# EAGLE design XIAO ESP32S3 Exp. Board v1.0 (EAGLE 9.6.2)
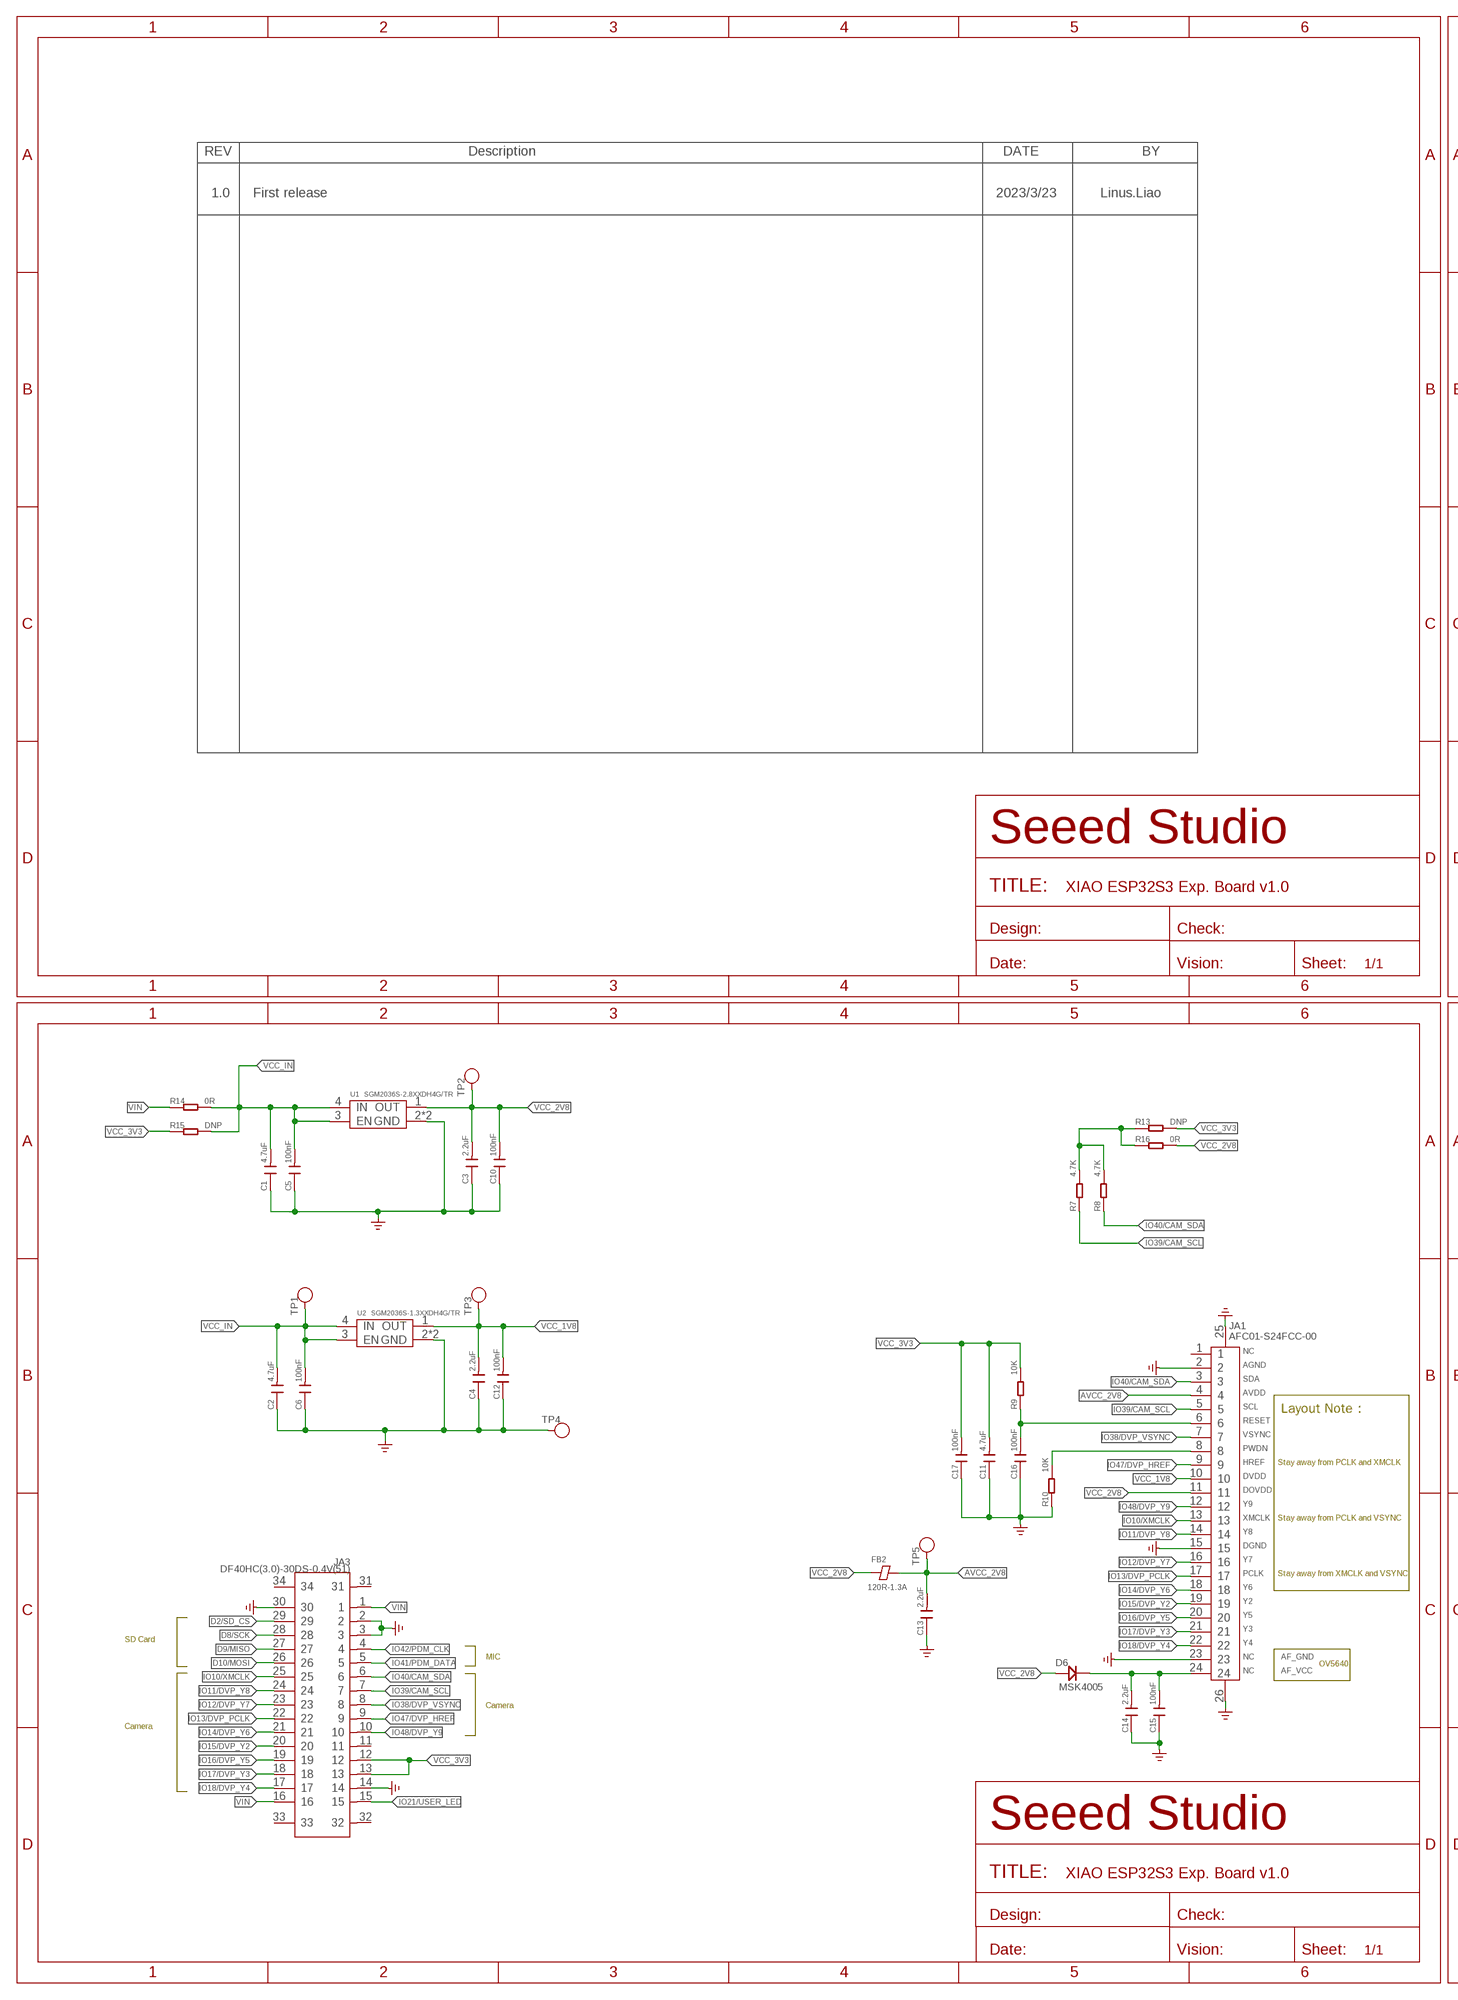
[diagram p0: schematic, sheet 1, part 1 of 2]
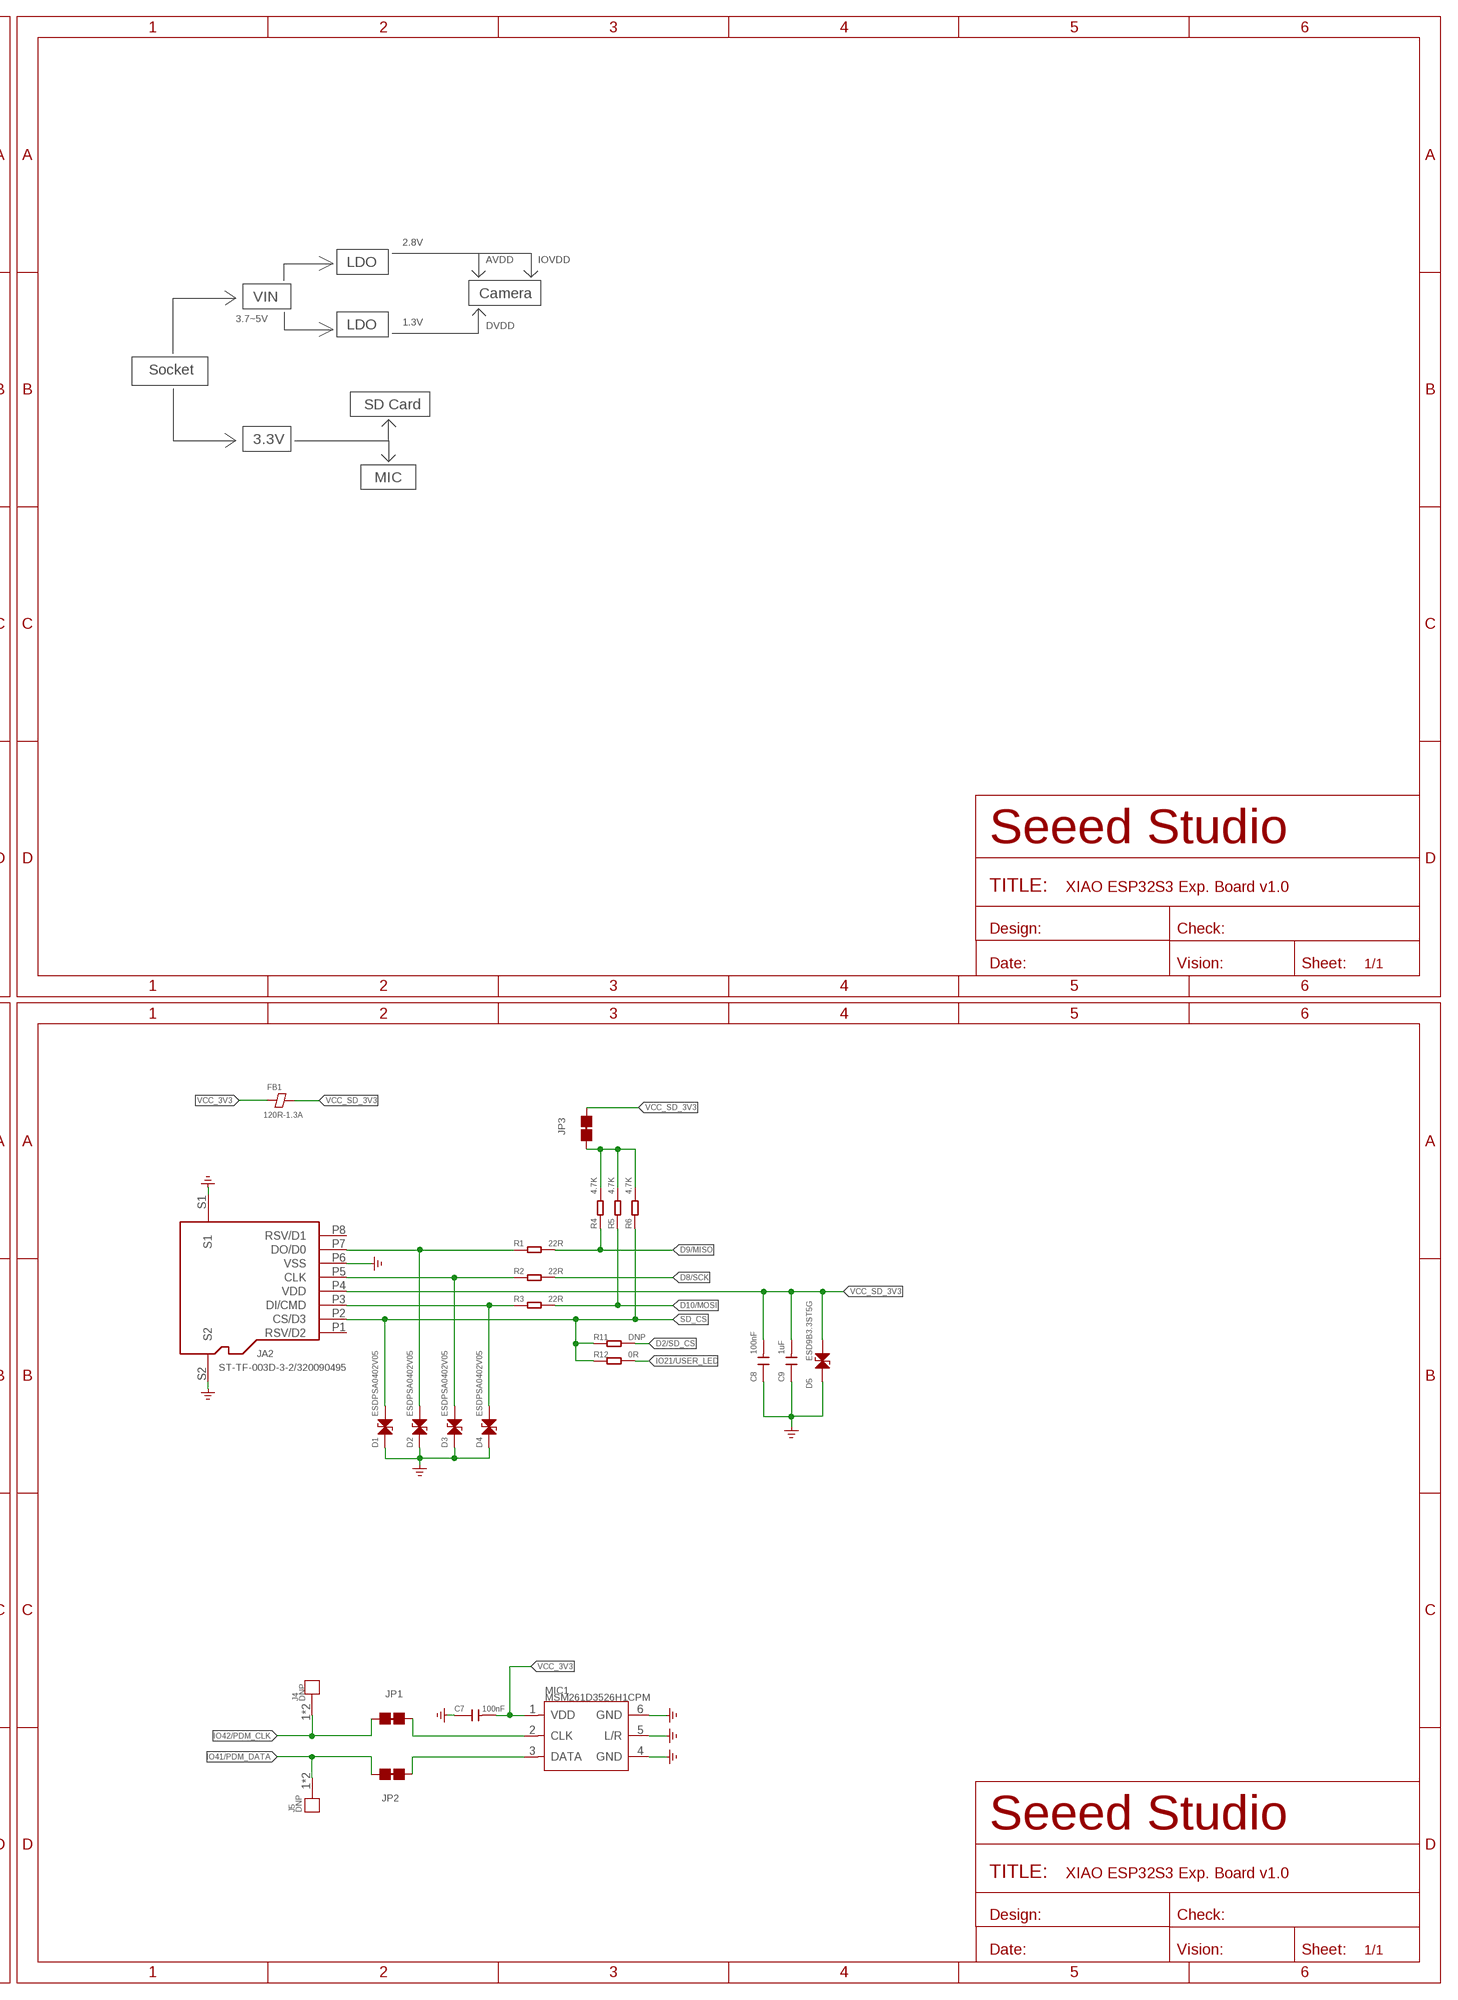
[diagram p1: schematic, sheet 1, part 2 of 2]

## Parts
C1  4.7uF  C-0402  [C0402]
C2  4.7uF  C-0402  [C0402]
C3  2.2uF  C-0402  [C0402]
C4  2.2uF  C-0402  [C0402]
C5  100nF  C-0402  [C0402]
C6  100nF  C-0402  [C0402]
C7  100nF  C-0402  [C0402]
C8  100nF  C-0402  [C0402]
C9  1uF  C-0402  [C0402]
C10  100nF  C-0402  [C0402]
C11  4.7uF  C-0402  [C0402]
C12  100nF  C-0402  [C0402]
C13  2.2uF  C-0402  [C0402]
C14  2.2uF  C-0402  [C0402]
C15  100nF  C-0402  [C0402]
C16  100nF  C-0402  [C0402]
C17  100nF  C-0402  [C0402]
D1  ESDPSA0402V05  D-ESD-2P-DOUBLE  [ESD-0402-NO-SILK]
D2  ESDPSA0402V05  D-ESD-2P-DOUBLE  [ESD-0402-NO-SILK]
D3  ESDPSA0402V05  D-ESD-2P-DOUBLE  [ESD-0402-NO-SILK]
D4  ESDPSA0402V05  D-ESD-2P-DOUBLE  [ESD-0402-NO-SILK]
D5  ESD9B3.3ST5G  D-ESD-2P-DOUBLE  [ESD-0402-NO-SILK]
D6  MSK4005  DIODE'0603'  [SOD-523]
FB1  120R-1.3A  FERRITE-BEAD-0402  [F0402]
FB2  120R-1.3A  FERRITE-BEAD-0402  [F0402]
J4  DNP  HEADER-1P-HALF-HOLE  [H1-HALF-HOLE-2.54]
J5  DNP  HEADER-1P-HALF-HOLE  [H1-HALF-HOLE-2.54]
JA1  AFC01-S24FCC-00  FPC-CONNECTOR-24P  [FPCB24-SMD-0.5-17.6X5.0X2MM]
JA2  ST-TF-003D-3-2/320090495  MICRO-SD-CARD-HOLDER-SHORT-8P  [MICRO-SD8+2P-SMD-1.1-11.41X4.9X3MM]
JA3  DF40HC(3.0)-30DS-0.4V(51)  BTB-P4S30DF40HC-SOCKET  [BTB30-0.4-8.6X3.38X2.4MM]
JP1  JP-2P-SHORT  [2P-SMD-0603]
JP2  JP-2P-SHORT  [2P-SMD-0603]
JP3  JP-2P-SHORT  [2P-SMD-0603]
MIC1  MSM261D3526H1CPM  MIC-MSM261D3526H1CPM  [MIC6P-3.5X2.65X0.94MM]
R1  22R  R-0402  [R0402]
R2  22R  R-0402  [R0402]
R3  22R  R-0402  [R0402]
R4  4.7K  R-0402  [R0402]
R5  4.7K  R-0402  [R0402]
R6  4.7K  R-0402  [R0402]
R7  4.7K  R-0402  [R0402]
R8  4.7K  R-0402  [R0402]
R9  10K  R-0402  [R0402]
R10  10K  R-0402  [R0402]
R11  DNP  R-0402  [R0402]
R12  0R  R-0402  [R0402]
R13  DNP  R-0402  [R0402]
R14  0R  R-0402  [R0402]
R15  DNP  R-0402  [R0402]
R16  0R  R-0402  [R0402]
TP1  TEST-POINT-35  [TP_3535]
TP2  TEST-POINT-35  [TP_3535]
TP3  TEST-POINT-35  [TP_3535]
TP4  TEST-POINT-35  [TP_3535]
TP5  TEST-POINT-35  [TP_3535]
U1  SGM2036S-2.8XXDH4G/TR  TLV733P  [X2SON-4]
U2  SGM2036S-1.3XXDH4G/TR  TLV733P  [X2SON-4]

## Nets
AVCC_2V8: C13.2 FB2.2 JA1.4 TP5.T
D2/SD_CS: JA3.29 R11.2
D8/SCK: JA3.28 R2.2
D9/MISO: JA3.27 R1.2 R4.1
D10/MOSI: JA3.26 R3.2 R5.1
GND: C1.1 C2.1 C3.1 C4.1 C5.1 C6.1 C7.1 C8.1 C9.1 C10.1 C11.1 C12.1 C13.1 C14.1 C15.1 C16.1 C17.1 D1.1 D2.1 D3.1 D4.1 D5.1 JA1.2 JA1.15 JA1.23 JA1.25(P1) JA1.26(P2) JA2.P6(VSS) JA2.S1 JA2.S2 JA3.2 JA3.3 JA3.14 JA3.30 MIC1.4(GND) MIC1.5(L/R) MIC1.6(GND) R10.1 TP4.T U1.2(GND) U1.T(GND) U2.2(GND) U2.T(GND) ; supply symbol labelled GND_POWER
IO10/XMCLK: JA1.13 JA3.25
IO11/DVP_Y8: JA1.14 JA3.24
IO12/DVP_Y7: JA1.16 JA3.23
IO13/DVP_PCLK: JA1.17 JA3.22
IO14/DVP_Y6: JA1.18 JA3.21
IO15/DVP_Y2: JA1.19 JA3.20
IO16/DVP_Y5: JA1.20 JA3.19
IO17/DVP_Y3: JA1.21 JA3.18
IO18/DVP_Y4: JA1.22 JA3.17
IO21/USER_LED: JA3.15 R12.2
IO38/DVP_VSYNC: JA1.7 JA3.8
IO39/CAM_SCL: JA1.5 JA3.7 R7.1
IO40/CAM_SDA: JA1.3 JA3.6 R8.1
IO41/PDM_DATA: J5.1 J5.2 JA3.5 JP2.P2
IO42/PDM_CLK: J4.1 J4.2 JA3.4 JP1.P1
IO47/DVP_HREF: JA1.9 JA3.9
IO48/DVP_Y9: JA1.12 JA3.10
N$1: JP1.P2 MIC1.2(CLK)
N$2: JP2.P1 MIC1.3(DATA)
N$3: D2.2 JA2.P7(DO/D0) R1.1
N$4: D3.2 JA2.P5(CLK) R2.1
N$5: JP3.P1 R4.2 R5.2 R6.2
N$6: D4.2 JA2.P3(DI/CMD) R3.1
N$7: C16.2 JA1.6 R9.1
N$8: C14.2 C15.2 D6.- JA1.24
N$9: R7.2 R8.2 R13.1 R16.1
N$10: JA1.8 R10.2
SD_CS: D1.2 JA2.P2(CS/D3) R6.1 R11.1 R12.1
VCC_1V8: C4.2 C12.2 JA1.10 TP3.T U2.1(OUT)
VCC_2V8: C3.2 C10.2 D6.+ FB2.1 JA1.11 R16.2 TP2.T U1.1(OUT)
VCC_3V3: C7.2 C11.2 C17.2 FB1.1 JA3.12 JA3.13 MIC1.1(VDD) R9.2 R13.2 R15.1
VCC_IN: C1.2 C2.2 C5.2 C6.2 R14.2 R15.2 TP1.T U1.3(EN) U1.4(IN) U2.3(EN) U2.4(IN)
VCC_SD_3V3: C8.2 C9.2 D5.2 FB1.2 JA2.P4(VDD) JP3.P2
VIN: JA3.1 JA3.16 R14.1
Unconnected: JA1.1 JA2.P1(RSV/D2) JA2.P8(RSV/D1) JA3.11 JA3.31 JA3.32 JA3.33 JA3.34

## Notes on the sheet
- 1.0 | First release | 2023/3/23 | Linus.Liao
- 2.8V
- AVDD | IOVDD
- LDO
- VIN | Camera
- 3.7~5V
- 1.3V
- LDO | DVDD
- Socket
- SD Card
- 3.3V
- MIC
- NC
- AGND
- SDA
- AVDD
- SCL
- Layout Note：
- RESET
- VSYNC
- PWDN
- HREF | Stay away from PCLK and XMCLK
- DVDD
- DOVDD
- Y9
- XMCLK | Stay away from PCLK and VSYNC
- Y8
- DGND
- Y7
- PCLK | Stay away from XMCLK and VSYNC
- Y6
- Y2
- Y5
- Y3
- SD Card
- Y4
- MIC | NC | AF_GND
- OV5640
- NC | AF_VCC
- Camera
- Camera

## Library data of the parts
C1-C17 = Discrete-small:C*: Ceramic Capacitors
D1-D5 = Discrete-new:D-ESD-2P-DOUBLE
D6 = Discrete-new:DIODE
FB1 FB2 = Discrete-new:FERRITE-BEAD
J4 J5 = Connector-new:HEADER-1P
JA1 = Connector-new:FPC-CONNECTOR-24P
JA2 = Connector-new:MICRO-SD-CARD-HOLDER-SHORT-8P
JA3 = Connector-new:BTB-P4S30
JP1-JP3 = Discrete-new:JP-2P-SHORT
MIC1 = Making:MIC-MSM261D3526H1CPM
R1-R16 = Discrete-small:R*
TP1-TP5 = Discrete-new:TEST-POINT
U1 U2 = GroveX:TLV733P

## Net classes
0 default: width 0.089 mm, drill 0.2 mm, clearance 0.102 mm

## Board
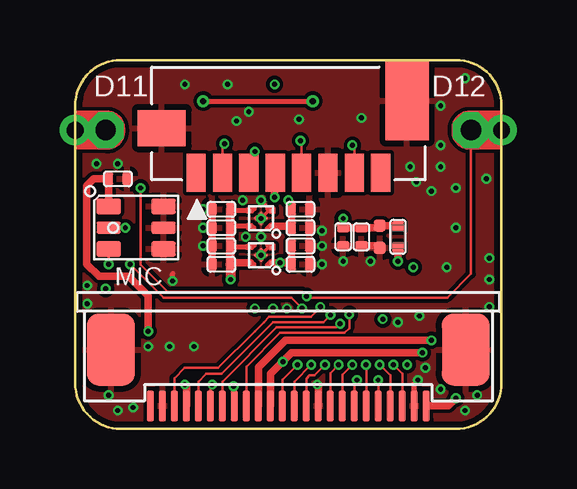
[diagram p2: board, top side]
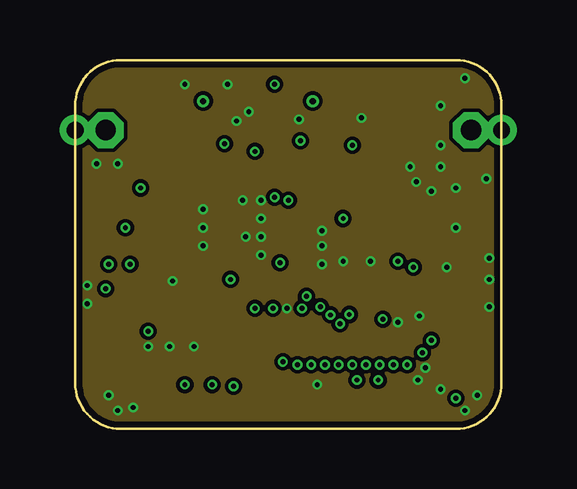
[diagram p3: board, inner layer Route2]
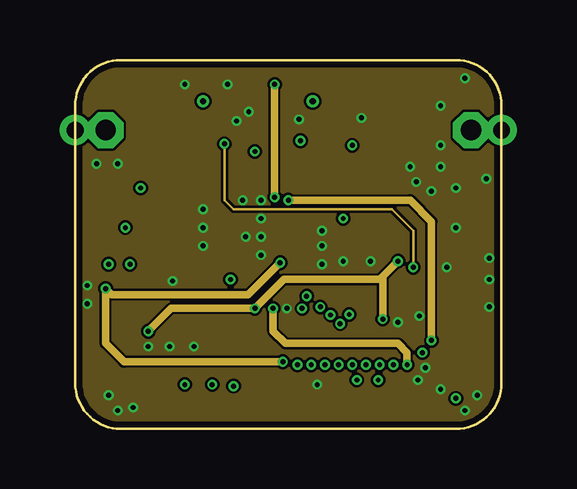
[diagram p4: board, inner layer Route15]
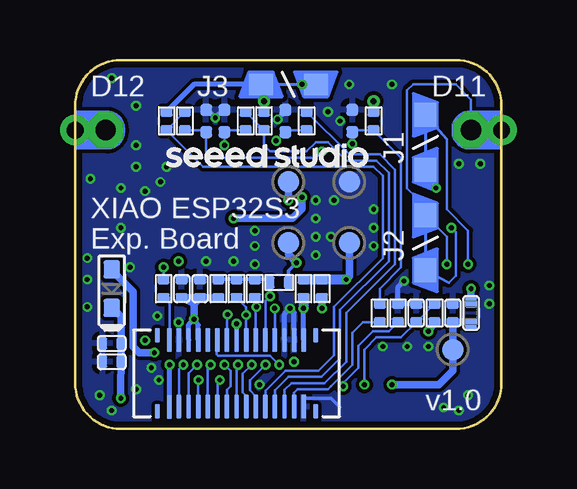
[diagram p5: board, bottom side, seen from below]

Size 17.78 x 15.37 mm. Coordinates in mm from the lower left corner, seen from the top.
Outline: 0,1.9 0,13.46 arc-90 1.91,15.37 15.88,15.37 arc-90 17.78,13.46 17.78,1.9 arc-90 15.88,0 1.91,0 arc-90 0,1.9
Copper layers (1*2*15*16): Top 0.035mm / dielectric 0.2mm / Route2 0.0175mm / dielectric 0.3mm / Route15 0.0175mm / dielectric 0.2mm / Bottom 0.035mm
Design rules "SeeedStudio_4layer_DRU_no_angle_20140221 *": minimum track width 1mil, minimum drill 8mil, track to track 4mil, track to pad 4mil, pad to pad 4mil, via to via 4mil, smd to smd 0mil, copper to edge 10mil, drill to drill 8mil, minimum pad ring 4mil, minimum via ring 4mil, stop-mask expansion 4mil, vias tented up to drill 25mil, thermal gap 10mil

### Footprints (pad centres in the part's own frame; a part is rotated, then mirrored left to right if it is on the bottom)
C0402 = smd 0.385 x 0.508: 1 0.383,0; 2 -0.383,0
ESD-0402-NO-SILK = smd 0.5 x 0.5: 1 -0.463,0; 2 0.463,0
SOD-523 = smd 0.762 x 0.7: + 0.8,0; - -0.8,0
F0402 = smd 0.445 x 0.508: 1 -0.445,0; 2 0.445,0
H1-HALF-HOLE-2.54 = drill 0.85 pad 1.5 octagon: 1 0,0 | drill 0.7 pad 1.27: 2 -1.27,0
FPCB24-SMD-0.5-17.6X5.0X2MM = smd 0.3 x 1.3: 1 5.75,0; 2 5.25,0; 3 4.75,0; 4 4.25,0; 5 3.75,0; 6 3.25,0; 7 2.75,0; 8 2.25,0; 9 1.75,0; 10 1.25,0; 11 0.75,0; 12 0.25,0; 13 -0.25,0; 14 -0.75,0; 15 -1.25,0; 16 -1.75,0; 17 -2.25,0; 18 -2.75,0; 19 -3.25,0; 20 -3.75,0; 21 -4.25,0; 22 -4.75,0; 23 -5.25,0; 24 -5.75,0 | smd 2 x 3: 25 -7.4,-2.35; 26 7.4,-2.35
MICRO-SD8+2P-SMD-1.1-11.41X4.9X3MM = smd 1.6 x 0.8: P1 0,3.85; P2 0,2.75; P3 0,1.65; P4 0,0.55; P5 0,-0.55; P6 0,-1.65; P7 0,-2.75; P8 0,-3.85 | smd 1.5 x 2: S1 1.86,5.28 | smd 3.3 x 1.8: S2 3,-4.95
BTB30-0.4-8.6X3.38X2.4MM = smd 0.2 x 1: 1 -2.8,-1.39; 2 -2.4,-1.39; 3 -2,-1.39; 4 -1.6,-1.39; 5 -1.2,-1.39; 6 -0.8,-1.39; 7 -0.4,-1.39; 8 0,-1.39; 9 0.4,-1.39; 10 0.8,-1.39; 11 1.2,-1.39; 12 1.6,-1.39; 13 2,-1.39; 14 2.4,-1.39; 15 2.8,-1.39; 16 2.8,1.4; 17 2.4,1.39; 18 2,1.39; 19 1.6,1.39; 20 1.2,1.39; 21 0.8,1.39; 22 0.4,1.39; 23 0,1.39; 24 -0.4,1.39; 25 -0.8,1.39; 26 -1.2,1.39; 27 -1.6,1.39; 28 -2,1.39; 29 -2.4,1.39; 30 -2.8,1.39 | smd 0.2 x 0.6: 31 -3.3,-1.59; 32 3.3,-1.59; 33 3.3,1.59; 34 -3.3,1.59
2P-SMD-0603 = smd 1 x 0.9: P1 -1.143,0; P2 1.143,0
MIC6P-3.5X2.65X0.94MM = smd 0.635 x 1.016: 1 0.889,1.143; 3 -0.889,1.143; 4 -0.889,-1.143; 6 0.889,-1.143 | smd 0.508 x 1.016: 2 0,1.143; 5 0,-1.143
R0402 = smd 0.385 x 0.508: 1 0.383,0; 2 -0.383,0
TP_3535 = smd 0.889 x 0.889: T 0,0
X2SON-4 = smd 0.152 x 0.152: 1 -0.445,0.318; 2 -0.445,-0.318; 3 0.445,-0.318; 4 0.445,0.318 | smd 0.45 x 0.45 rotated 45: T 0,0

### Placement (x,y rotation side)
C1  6.1,6.86 180 top
C2  6.1,8.38 180 top
C3  9.4,6.86 0 top
C4  9.4,9.14 0 top
C5  6.1,7.62 180 top
C6  6.1,9.14 180 top
C7  1.78,10.41 0 top
C8  11.18,8 270 top
C9  11.94,8 270 top
C10  9.4,7.62 0 top
C11  12.57,5.84 90 bottom
C12  9.4,8.38 0 top
C13  2.03,4.83 90 bottom
C14  16.26,3.56 180 bottom
C15  16.26,2.79 180 bottom
C16  3.56,4.83 90 bottom
C17  13.33,5.84 90 bottom
D1  6.22,12.83 270 bottom
D2  11.56,12.83 270 bottom
D3  9.02,12.83 270 bottom
D4  12.32,12.83 270 bottom
D5  12.7,8 90 top
D6  16.26,5.84 90 bottom
FB1  13.46,8 90 top
FB2  1.27,4.83 270 bottom
J4  1.27,12.45 0 top
J5  16.51,12.45 180 top
JA1  8.89,0.95 180 top
JA2  8.89,10.67 90 top
JA3  11.05,2.31 180 bottom
JP1  3.17,7.75 270 bottom
JP2  3.17,11.94 270 bottom
JP3  8.89,14.35 0 bottom
MIC1  2.54,8.38 90 top
R1  10.67,12.83 270 bottom
R2  8.13,12.83 270 bottom
R3  13.21,12.83 270 bottom
R4  9.91,12.83 270 bottom
R5  13.97,12.83 270 bottom
R6  5.33,12.83 270 bottom
R7  11.05,5.84 270 bottom
R8  10.29,5.84 270 bottom
R9  2.79,4.83 90 bottom
R10  4.32,4.83 90 bottom
R11  5.08,4.83 90 bottom
R12  14.1,5.84 90 bottom
R13  11.81,5.84 90 bottom
R14  8.26,5.84 270 bottom
R15  7.49,5.84 270 bottom
R16  9.27,6.1 180 bottom
TP1  6.35,7.75 0 bottom
TP2  8.89,7.75 0 bottom
TP3  8.89,10.29 0 bottom
TP4  6.35,10.29 0 bottom
TP5  2.03,3.3 270 bottom
U1  7.75,7.24 180 top
U2  7.75,8.76 180 top
U$6  [LOGO-SEEED-NEW-0.94X8.4MM]  13.97,10.92 0 bottom

### Tracks (layer width: path | path; a pad name or v marks a point on that pad's centre or on a via)
AVCC_2V8  (via drill 0.2 pad 0.41)
  Top 0.305: JA1.4 4.64,1.77 v4.57,1.84
  Bottom 0.305: FB2.2 1.33,4.44 C13.2 TP5.T 2.03,2.41 2.6,1.84 v4.57,1.84
D2/SD_CS
  Bottom 0.102: 8.65,1.26 JA3.29 8.65,1.51 8.51,1.65 7.24,1.65 7.11,1.78 | 7.11,1.78 | R11.2 5.77,4.44 6.22,4 6.22,2.67 7.11,1.78
D8/SCK
  Bottom 0.102: R2.2 6.35,11.43 5.08,11.43 4.45,10.79 4.45,6.86 6.48,4.83 6.48,2.8 7.38,1.9 8.76,1.9 9.05,1.62 JA3.28
D9/MISO
  Bottom 0.102: R1.2 R4.1 9.91,11.81 9.65,11.56 8.13,11.56 7.75,11.94 7.24,11.94 6.48,11.18 5.21,11.18 4.7,10.67 4.7,6.98 6.73,4.95 6.73,2.93 7.51,2.16 8.89,2.16 9.45,1.6 JA3.27
D10/MOSI
  Bottom 0.102: R3.2 R5.1 12.45,10.92 5.33,10.92 4.95,10.54 4.95,7.11 6.98,5.08 6.98,3.07 7.64,2.41 9.02,2.41 9.85,1.58 JA3.26
GND  (via drill 0.2 pad 0.41)
  Top 0.152: U2.2 8.06,9.08 | 8.06,9.08 U2.T | U1.2 8.06,7.56 U1.T | 8.06,9.08 8.06,9.21 v7.75,9.52
  Top 0.203: JA1.23 14.14,1.88 v14.29,2.03 | v4.06,6.16 4.06,6.48
  Top 0.305: JA1.15 10.14,1.82 v10.1,1.84 | C1.1 C5.1 C2.1 C6.1 | C9.1 12.62,7.62 D5.1
  Bottom 0.152: JA3.2 8.65,4.14 | JA3.30 8.25,1.26 8.13,1.27 7.11,1.27 6.73,0.89
  Bottom 0.203: JA3.3 9.05,4.79 v8.83,5.02 8.65,4.84 8.65,4.14 | D4.1 12.27,13.29 v11.94,12.95 11.6,13.29 D2.1 | v9.33,12.89 9.02,13.21 D3.1 | C16.1 R10.1 4.32,5.91 v4.06,6.16
  other vias: 5.33,9.14 7.75,8 10.29,7.62 10.29,8.25 17.27,6.22 7.24,13.21 1.4,1.4 2.41,0.89 16.26,0.76 13.46,4.45 15.24,10.92 13.97,10.92 15.24,13.46 16.26,14.61 5.33,7.62 5.33,8.38 6.73,12.83 17.15,10.41 17.27,7.11 14.22,10.29 7.11,8 6.98,9.52 15.88,10.03 14.86,9.91 15.49,6.73 0.89,11.05 7.75,7.24 7.75,8.76 11.18,6.98 12.32,6.98 10.29,6.86 17.27,5.08 16.76,1.4 14.61,2.54 3.05,3.43 3.94,3.43 0.51,5.97 0.51,5.21 1.78,0.76 4.95,3.43 15.24,1.65 14.35,4.7 6.35,14.35 4.57,14.35 1.78,11.05 15.24,11.81 15.88,8.38
  pour Top (isolate 0.152): 0,15.37 17.78,15.37 17.78,-0.25 0,-0.25
  pour Bottom (isolate 0.152): 0,15.37 17.78,15.37 17.78,-0.25 0,-0.25
  pour Route2 (isolate 0.152): 0,15.37 17.78,15.37 17.78,-0.25 0,-0.25
  pour Route15: 0,15.37 18.42,15.37 18.42,-0.25 0,-0.25
IO10/XMCLK  (via drill 0.2 pad 0.41)
  Top 0.102: JA1.13 9.14,1.96 v9.84,2.67
  Bottom 0.102: JA3.25 10.25,1.36 10.49,1.6 10.49,2.02 v9.84,2.67
IO11/DVP_Y8  (via drill 0.2 pad 0.41)
  Top 0.102: JA1.14 9.64,2.08 9.78,2.22 9.97,2.22 v10.41,2.67
  Bottom 0.102: JA3.24 10.65,1.38 10.79,1.52 10.79,2.29 v10.41,2.67
IO12/DVP_Y7  (via drill 0.2 pad 0.41)
  Top 0.102: JA1.16 10.64,2.32 v10.99,2.67
  Bottom 0.102: JA3.23 11.05,2.6 v10.99,2.67
IO13/DVP_PCLK  (via drill 0.2 pad 0.41)
  Top 0.102: JA1.17 11.14,2.25 v11.56,2.67
  Bottom 0.102: v11.56,2.67 11.3,2.41 11.3,1.78 11.45,1.63 JA3.22
IO14/DVP_Y6  (via drill 0.2 pad 0.41)
  Top 0.102: JA1.18 11.64,1.92 v11.75,2.03
  Bottom 0.102: JA3.21 11.85,1.93 v11.75,2.03
IO15/DVP_Y2  (via drill 0.2 pad 0.41)
  Top 0.102: JA1.19 12.14,2.66 v12.13,2.67
  Bottom 0.102: JA3.20 12.25,2.55 v12.13,2.67
IO16/DVP_Y5  (via drill 0.2 pad 0.41)
  Top 0.102: JA1.20 12.64,1.91 v12.64,2.03
  Bottom 0.102: JA3.19 12.65,2.02 v12.64,2.03
IO17/DVP_Y3  (via drill 0.2 pad 0.41)
  Top 0.102: JA1.21 13.14,2.23 v12.7,2.67
  Bottom 0.102: JA3.18 13.05,2.32 v12.7,2.67
IO18/DVP_Y4  (via drill 0.2 pad 0.41)
  Top 0.102: 13.72,1.03 JA1.22 13.64,2.3 v13.27,2.67
  Bottom 0.102: JA3.17 13.45,2.49 v13.27,2.67
IO21/USER_LED
  Bottom 0.102: JA3.15 13.85,5.45 R12.2
IO38/DVP_VSYNC  (via drill 0.2 pad 0.41)
  Top 0.102: JA1.7 6.14,1.96 8.4,4.23 10.87,4.23 v11.05,4.38
  Bottom 0.102: JA3.8 v11.05,4.38
IO39/CAM_SCL  (via drill 0.2 pad 0.41)
  Top 0.102: v10.65,4.74 10.35,4.45 8.26,4.45 6.1,2.29 5.46,2.29 5.14,1.96 JA1.5
  Bottom 0.102: JA3.7 v10.65,4.74 10.65,5.06 R7.1
IO40/CAM_SDA  (via drill 0.2 pad 0.41)
  Top 0.102: v10.22,5.08 9.83,4.66 8.09,4.66 7.87,4.45 7.49,4.06 5.97,2.54 4.57,2.54 4.14,2.11 JA1.3
  Bottom 0.102: JA3.6 10.25,5.05 v10.22,5.08 10.22,5.39 R8.1
IO41/PDM_DATA  (via drill 0.2 pad 0.41)
  Top 0.102: J5.1 16.51,6.45 15.52,5.46 9.72,5.46 v9.65,5.52 9.46,5.71 3.86,5.71 2.73,6.85 v2.73,10.03
  Bottom 0.102: J5.1 J5.2 | JA3.5 9.85,5.33 v9.65,5.52 | JP2.P2 v2.73,10.03
IO42/PDM_CLK  (via drill 0.2 pad 0.41)
  Top 0.102: v9.46,5.02 9.02,5.46 3.68,5.46 v2.29,6.86
  Bottom 0.102: J4.2 J4.1 1.27,13.72 1.91,14.35 3.68,14.35 3.94,14.1 3.94,10.03 3.56,9.65 3.56,9.27 JP1.P1 2.29,8 v2.29,6.86 | JA3.4 9.45,5 v9.46,5.02
IO47/DVP_HREF  (via drill 0.2 pad 0.41)
  Top 0.102: JA1.9 7.14,2.59 8.55,4 11.24,4 11.43,4.19 v11.43,4.76
  Bottom 0.102: JA3.9 11.45,4.74 v11.43,4.76
IO48/DVP_Y9  (via drill 0.2 pad 0.41)
  Top 0.102: JA1.12 8.64,2.04 v9.27,2.67
  Bottom 0.102: JA3.10 11.87,3.73 11.87,3.11 11.81,3.05 9.65,3.05 v9.27,2.67
N$1  (via drill 0.2 pad 0.41)
  Top 0.102: MIC1.2 v2.09,8.38
  Bottom 0.102: JP1.P2 2.19,6.1 1.91,6.38 1.91,8.19 v2.09,8.38
N$2  (via drill 0.2 pad 0.41)
  Top 0.102: v1.4,6.86 MIC1.3
  Bottom 0.102: v1.4,6.86 1.4,8.25 2.29,9.14 2.29,12.07 JP2.P1
N$3  (via drill 0.2 pad 0.41)
  Top 0.102: JA2.P7 11.64,11.73 v11.56,11.81
  Bottom 0.102: v11.56,11.81 D2.2 11.51,12.44 R1.1
N$4  (via drill 0.2 pad 0.41)
  Top 0.102: JA2.P5 9.44,11.96 v9.4,12
  Bottom 0.102: R2.1 8.94,12.44 D3.2 v9.4,12
N$5  (via drill 0.25 pad 0.51)
  Top 0.203: v5.33,13.65 v9.91,13.65
  Bottom 0.203: v9.91,13.65 9.91,13.84 | R5.2 12.83,14.35 JP3.P1 9.91,14.22 v9.91,13.65 | R6.2 v5.33,13.65 | v9.91,13.65 R4.2
N$6  (via drill 0.2 pad 0.41)
  Top 0.102: 7.24,10.54 JA2.P3 7.49,10.92 v7.49,11.56
  Bottom 0.102: R3.1 12.53,12.44 D4.2 | D4.2 12.45,12.45 | D4.2 12.32,11.56 12.06,11.3 7.75,11.3 v7.49,11.56
N$7  (via drill 0.2 pad 0.41)
  Top 0.102: JA1.6 5.64,1.79 v5.71,1.84
  Bottom 0.102: R9.1 C16.2 4.19,3.81 5.21,3.81 5.71,3.3 v5.71,1.84
N$8  (via drill 0.2 pad 0.41)
  Top 0.305: JA1.24 15.56,0.95 v15.88,1.27
  Bottom 0.305: v15.88,1.27 15.88,1.78 C15.2 15.87,3.37 C14.2 15.87,4.66 D6.-
N$9
  Bottom 0.152: R13.1 R7.2 R8.2 9.78,6.22 R16.1
N$10  (via drill 0.2 pad 0.41)
  Top 0.102: JA1.8 6.64,1.74 v6.6,1.78
  Bottom 0.102: v6.6,1.78 6.6,1.9 5.97,2.54 5.97,3.46 5.37,4.06 4.7,4.06 R10.2
SD_CS  (via drill 0.2 pad 0.41)
  Top 0.102: JA2.P2 6.14,11.79 v6.22,11.88
  Route15 0.102: v14.1,6.73 14.1,8.25 13.21,9.14 6.6,9.14 6.22,9.52 v6.22,11.88
  Bottom 0.102: v6.22,11.88 D1.2 6.14,12.44 R6.1 4.19,11.3 4.19,6.73 5.08,5.84 R11.1 | R12.1 v14.1,6.73
VCC_1V8  (via drill 0.2 pad 0.41)
  Top 0.305: U2.1 8.95,8.45 C12.2 C4.2 9.02,9.4 v8.89,9.52 | JA1.10 7.64,2.56 8.76,3.68 v14.86,3.68
  Route15 0.305: v14.86,3.68 14.86,8.64 13.97,9.52 v8.89,9.52
  Bottom 0.305: 8.76,10.16 TP3.T v8.89,9.52
VCC_2V8  (via drill 0.2 pad 0.41)
  Top 0.102: 9.02,3.17 9.02,3.15 v8.66,2.79
  Top 0.305: 9.02,7.24 | U1.1 v8.55,6.92 8.95,6.92 C3.2 9.02,7.24 | JA1.11 8.14,2.3 9.02,3.17 v14.48,3.17 | 9.02,7.24 C10.2
  Route15 0.305: v8.66,2.79 2.03,2.79 1.27,3.56 v1.27,5.84 1.52,5.59 7.21,5.59 v8.55,6.92
  Bottom 0.152: R16.2 8.89,6.58 v8.55,6.92
  Bottom 0.305: TP2.T 8.89,7.26 v8.55,6.92 | FB2.1 v1.27,5.84 | D6.+ 16.26,6.6 15.37,5.71 15.37,3.43 15.11,3.17 v14.48,3.17
VCC_3V3  (via drill 0.2 pad 0.41)
  Top 0.305: MIC1.1 C7.2 0.76,10.41 0.48,10.13 0.48,6.86 0.99,6.35 2.24,6.35 3.05,5.54 v3.05,4.06 | v13.46,6.98 FB1.1
  Route15 0.305: 12.83,6.35 12.7,6.22 8.7,6.22 v7.49,5.02 4,5.02 v3.05,4.06 | 12.83,6.35 v13.46,6.98 | v12.83,4.57 12.83,6.35
  Bottom 0.203: 13.05,5.43 C17.2 | JA3.13 13.05,4.35 v12.83,4.57 12.65,4.33 JA3.12
  Bottom 0.305: R15.1 v7.49,5.02 | C11.2 C17.2 12.83,5.2 | R9.2 v3.05,4.06 | C11.2 12.2,5.46 | v12.83,4.57 12.83,5.2 | 12.83,5.2 12.83,5.21 C11.2 | R13.2 C11.2
VCC_IN  (via drill 0.2 pad 0.41)
  Top 0.203: U2.4 6.54,8.45 C2.2 | U2.3 6.54,9.08 C6.2 | U1.3 6.54,7.56 C5.2
  Top 0.305: U1.4 6.54,6.92 C1.2
  Top 0.381: C1.2 C5.2 C2.2 C6.2
  Top 0.406: C1.2 v6.48,6.22
  Bottom 0.305: R14.2 R15.2 | TP1.T 6.6,7.75 | R15.2 7.61,6.22 | TP1.T 6.35,7.48 | R15.2 v6.48,6.22 6.35,6.35 TP1.T
  Bottom 0.406: R14.2 R15.2 v6.48,6.22
VCC_SD_3V3  (via drill 0.2 pad 0.41)
  Top 0.305: C9.2 C8.2 v11.18,8.76 | C9.2 11.38,8.38 | C9.2 12.62,8.38 D5.2 | 12.78,8.38 D5.2 | v8.32,9.65 8.32,10.65 JA2.P4 | D5.2 13.44,8.46 FB1.2
  Route15 0.305: v8.32,9.65 v8.32,14.35
  Bottom 0.305: v8.32,9.65 8.32,9.17 8.72,8.76 v11.18,8.76 | JP3.P2 v8.32,14.35
VIN  (via drill 0.2 pad 0.41)
  Route15 0.305: v13.84,2.67 13.84,3.17 13.46,3.56 8.76,3.56 8.26,4.06 v8.26,5.02
  Bottom 0.203: JA3.16 v13.85,2.66 v13.84,2.67 | JA3.1 v8.25,5.01 v8.26,5.02
  Bottom 0.305: 8.26,5.08 v8.26,5.02
  Bottom 0.406: R14.1 8.26,5.08

### Text on the board
tPlace: D11 | D12 | MIC
bPlace: v1.0
bNames: D11 | J3 | D12 | J1 | XIAO ESP32S3 | J2 | Exp. Board
Reference: SD Card | Type_C